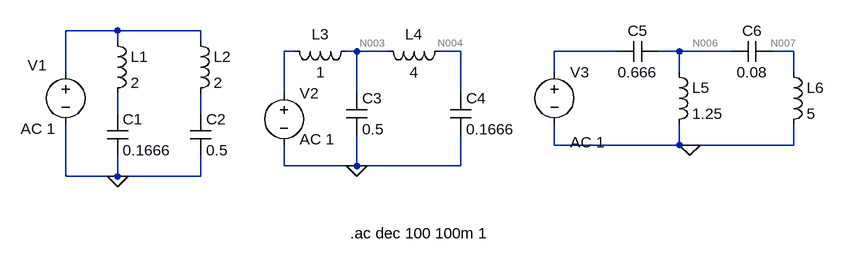
[diagram p0: schematic punto_1.asc]
punto_1.asc, the LTspice schematic file:
Version 4
SHEET 1 1124 680
WIRE 32 48 -48 48
WIRE 160 48 32 48
WIRE 32 64 32 48
WIRE 160 64 160 48
WIRE 304 80 288 80
WIRE 400 80 384 80
WIRE 448 80 400 80
WIRE 560 80 528 80
WIRE 800 80 704 80
WIRE 896 80 864 80
WIRE 976 80 896 80
WIRE 1072 80 1040 80
WIRE -48 112 -48 48
WIRE 704 112 704 80
WIRE 896 112 896 80
WIRE 1072 112 1072 80
WIRE 288 144 288 80
WIRE 400 144 400 80
WIRE 560 144 560 80
WIRE 32 176 32 144
WIRE 160 176 160 144
WIRE 704 224 704 192
WIRE 896 224 896 192
WIRE 896 224 704 224
WIRE 912 224 896 224
WIRE 1072 224 1072 192
WIRE 1072 224 912 224
WIRE 288 256 288 224
WIRE 400 256 400 208
WIRE 400 256 288 256
WIRE 560 256 560 208
WIRE 560 256 400 256
WIRE -48 272 -48 192
WIRE 32 272 32 240
WIRE 32 272 -48 272
WIRE 160 272 160 240
WIRE 160 272 32 272
FLAG 32 272 0
FLAG 400 256 0
FLAG 912 224 0
SYMBOL ind 16 48 R0
SYMATTR InstName L1
SYMATTR Value 2
SYMBOL ind 144 48 R0
SYMATTR InstName L2
SYMATTR Value 2
SYMBOL cap 16 176 R0
SYMATTR InstName C1
SYMATTR Value 0.1666
SYMBOL cap 144 176 R0
SYMATTR InstName C2
SYMATTR Value 0.5
SYMBOL voltage -48 96 R0
WINDOW 0 -58 5 Left 2
WINDOW 123 -69 103 Left 2
WINDOW 39 0 0 Left 0
SYMATTR InstName V1
SYMATTR Value ""
SYMATTR Value2 AC 1
SYMBOL ind 400 64 R90
WINDOW 0 5 56 VBottom 2
WINDOW 3 32 56 VTop 2
SYMATTR InstName L3
SYMATTR Value 1
SYMBOL ind 544 64 R90
WINDOW 0 5 56 VBottom 2
WINDOW 3 32 56 VTop 2
SYMATTR InstName L4
SYMATTR Value 4
SYMBOL cap 384 144 R0
SYMATTR InstName C3
SYMATTR Value 0.5
SYMBOL cap 544 144 R0
SYMATTR InstName C4
SYMATTR Value 0.1666
SYMBOL voltage 288 128 R0
WINDOW 123 24 87 Left 2
WINDOW 39 0 0 Left 0
SYMATTR InstName V2
SYMATTR Value ""
SYMATTR Value2 AC 1
SYMBOL voltage 704 96 R0
WINDOW 123 24 124 Left 2
WINDOW 39 0 0 Left 0
SYMATTR InstName V3
SYMATTR Value ""
SYMATTR Value2 AC 1
SYMBOL cap 864 64 R90
WINDOW 0 0 32 VBottom 2
WINDOW 3 32 32 VTop 2
SYMATTR InstName C5
SYMATTR Value 0.666
SYMBOL cap 1040 64 R90
WINDOW 0 0 32 VBottom 2
WINDOW 3 32 32 VTop 2
SYMATTR InstName C6
SYMATTR Value 0.08
SYMBOL ind 880 96 R0
SYMATTR InstName L5
SYMATTR Value 1.25
SYMBOL ind 1056 96 R0
SYMATTR InstName L6
SYMATTR Value 5
TEXT 390 360 Left 2 !.ac dec 100 100m 1

The netlist it stands for:
* punto_1.asc
L1 N001 N008 2
L2 N001 N009 2
C1 N008 0 0.1666
C2 N009 0 0.5
V1 N001 0 AC 1
L3 N003 N002 1
L4 N004 N003 4
C3 N003 0 0.5
C4 N004 0 0.1666
V2 N002 0 AC 1
V3 N005 0 AC 1
C5 N006 N005 0.666
C6 N007 N006 0.08
L5 N006 0 1.25
L6 N007 0 5
.ac dec 100 100m 1
.backanno
.end

* Results of the author's LTspice run, read from the files saved beside the schematic
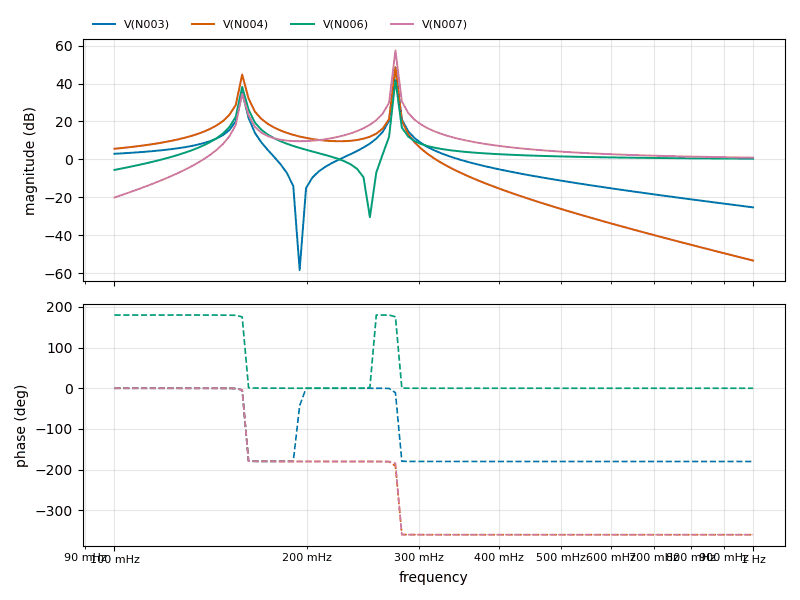
[diagram p1: AC Analysis of punto_1.asc, plotted from the saved traces]
* AC Analysis, 1 run:
*   V(N003): 2.93 dB at 100 mHz, -25.33 dB at 1 Hz, peak 48.46 dB at 275.4 mHz, 3 dB below the peak at 274.7 mHz and 276.1 mHz
*   V(N004): 5.59 dB at 100 mHz, -53.40 dB at 1 Hz, peak 48.49 dB at 275.4 mHz, 3 dB below the peak at 274.7 mHz and 276.1 mHz
*   V(N006): -5.58 dB at 100 mHz, 0.34 dB at 1 Hz, peak 41.82 dB at 275.4 mHz, 3 dB below the peak at 274.8 mHz and 276.2 mHz
*   V(N007): -20.11 dB at 100 mHz, 0.91 dB at 1 Hz, peak 57.46 dB at 275.4 mHz, 3 dB below the peak at 274.7 mHz and 276.1 mHz